# EAGLE design dc10 (EAGLE 5.06)
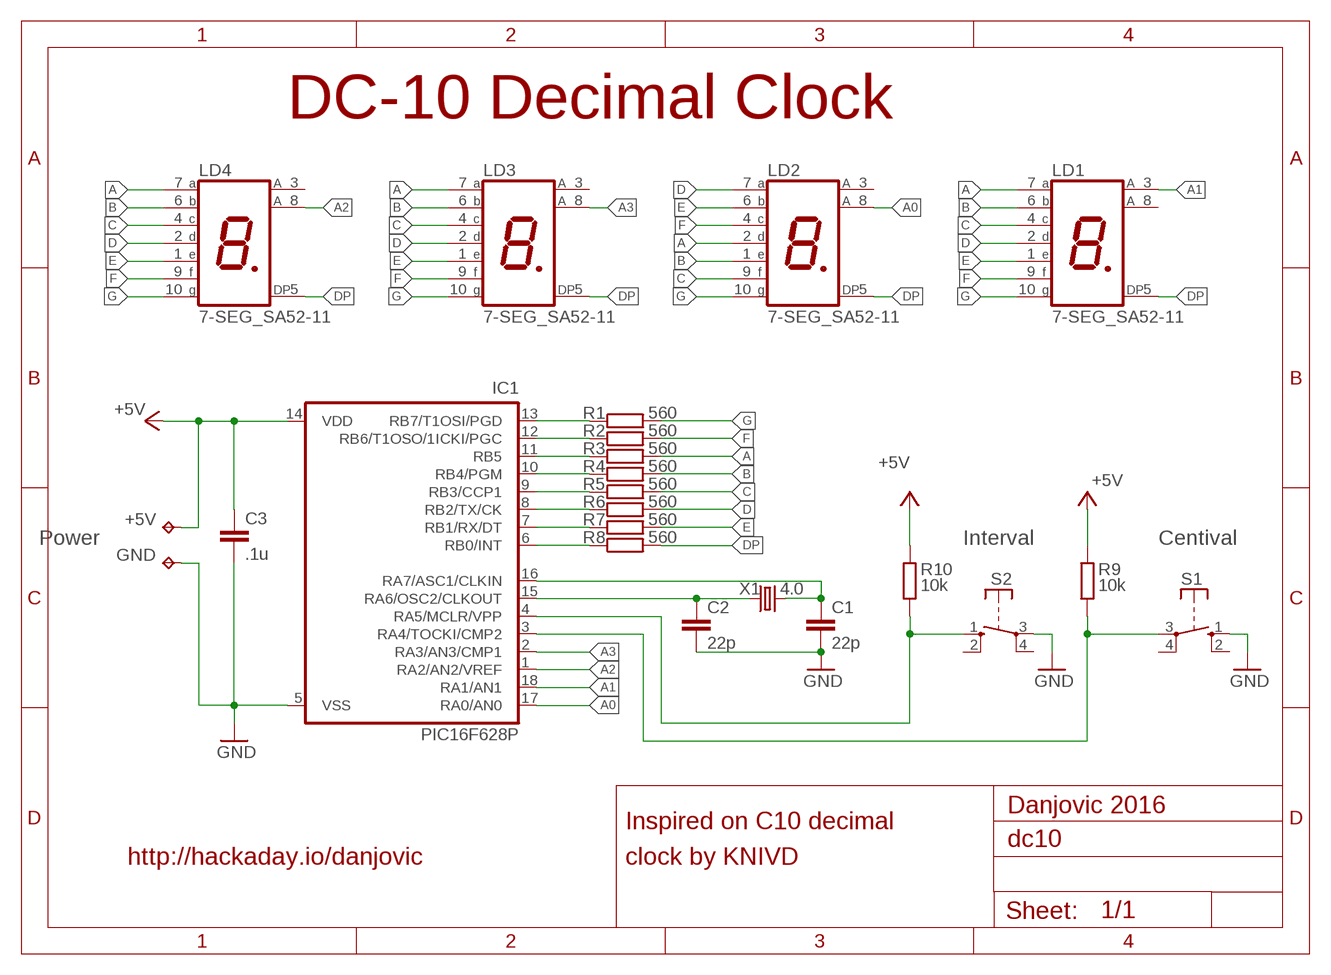
[diagram p0: schematic, sheet 1]

## Parts
+5V  TPPAD1-13  [P1-13]
C1  22p  C-EU050-024X044  [C050-024X044]
C2  22p  C-EU050-024X044  [C050-024X044]
C3  .1u  C-EU050-024X044  [C050-024X044]
GND  TPPAD1-13  [P1-13]
IC1  PIC16F628P  [DIL18]
LD1  7-SEG_SA52-11  [SA52-11]
LD2  7-SEG_SA52-11  [SA52-11]
LD3  7-SEG_SA52-11  [SA52-11]
LD4  7-SEG_SA52-11  [SA52-11]
R1  560  R-EU_0204/7  [0204/7]
R2  560  R-EU_0204/7  [0204/7]
R3  560  R-EU_0204/7  [0204/7]
R4  560  R-EU_0204/7  [0204/7]
R5  560  R-EU_0204/7  [0204/7]
R6  560  R-EU_0204/7  [0204/7]
R7  560  R-EU_0204/7  [0204/7]
R8  560  R-EU_0204/7  [0204/7]
R9  10k  R-EU_0204/7  [0204/7]
R10  10k  R-EU_0204/7  [0204/7]
S1  RACON12  [RACON12]
S2  RACON12  [RACON12]
X1  4.0  CRYSTALHC49U-V  [HC49U-V]

## Nets
+5V: +5V.1(TP) C3.1 IC1.14(VDD) R9.1 R10.1
A: LD1.7(A) LD2.2(D) LD3.7(A) LD4.7(A) R3.2
A0: IC1.17(RA0/AN0) LD2.8(A)
A1: IC1.18(RA1/AN1) LD1.3(A)
A2: IC1.1(RA2/AN2/VREF) LD4.8(A)
A3: IC1.2(RA3/AN3/CMP1) LD3.8(A)
A4: IC1.3(RA4/TOCKI/CMP2) R9.2 S1.3(P)
A5: IC1.4(RA5/MCLR/VPP) R10.2 S2.1(S)
B: LD1.6(B) LD2.1(E) LD3.6(B) LD4.6(B) R4.2
B0: IC1.6(RB0/INT) R8.1
B1: IC1.7(RB1/RX/DT) R7.1
B2: IC1.8(RB2/TX/CK) R6.1
B3: IC1.9(RB3/CCP1) R5.1
B4: IC1.10(RB4/PGM) R4.1
B5: IC1.11(RB5) R3.1
B6: IC1.12(RB6/T1OSO/1ICKI/PGC) R2.1
B7: IC1.13(RB7/T1OSI/PGD) R1.1
C: LD1.4(C) LD2.9(F) LD3.4(C) LD4.4(C) R5.2
D: LD1.2(D) LD2.7(A) LD3.2(D) LD4.2(D) R6.2
DP: LD1.5(DP) LD2.5(DP) LD3.5(DP) LD4.5(DP) R8.2
E: LD1.1(E) LD2.6(B) LD3.1(E) LD4.1(E) R7.2
F: LD1.9(F) LD2.4(C) LD3.9(F) LD4.9(F) R2.2
G: LD1.10(G) LD2.10(G) LD3.10(G) LD4.10(G) R1.2
GND: C1.2 C2.2 C3.2 GND.1(TP) IC1.5(VSS) S1.1(S) S2.3(P)
OSC1: C1.1 IC1.16(RA7/ASC1/CLKIN) X1.2
OSC2: C2.1 IC1.15(RA6/OSC2/CLKOUT) X1.1
Unconnected: LD1.8(A) LD2.3(A) LD3.3(A) LD4.3(A) S1.2(S) S1.4(P) S2.2(S) S2.4(P)

## Notes on the sheet
- DC-10 Decimal Clock
- Power | Interval | Centival
- Danjovic 2016
- Inspired on C10 decimal
- http://hackaday.io/danjovic | clock by KNIVD

## Library data of the parts
+5V GND = testpad:TP: Test pad
C1-C3 = rcl:C-EU: CAPACITOR, European symbol
IC1 = microchip:PIC16*F62: FLASH-Based 8-Bit CMOS Microcontroller Source: http://ww1.microchip.com/downloads/en/DeviceDoc/40300C.pdf
LD1-LD4 = display-kingbright:7-SEG_: Kingbright 14.2mm (0.56 INCH) SINGLE DIGIT NUMERIC DUISPLAY Source: SA56-11EWA(Ver1189471036.pdf
R1-R10 = rcl:R-EU_: RESISTOR, European symbol
S1 S2 = switch-misc:RACON12: ITT SWITCH
X1 = crystal:CRYSTAL: CRYSTAL

## Board
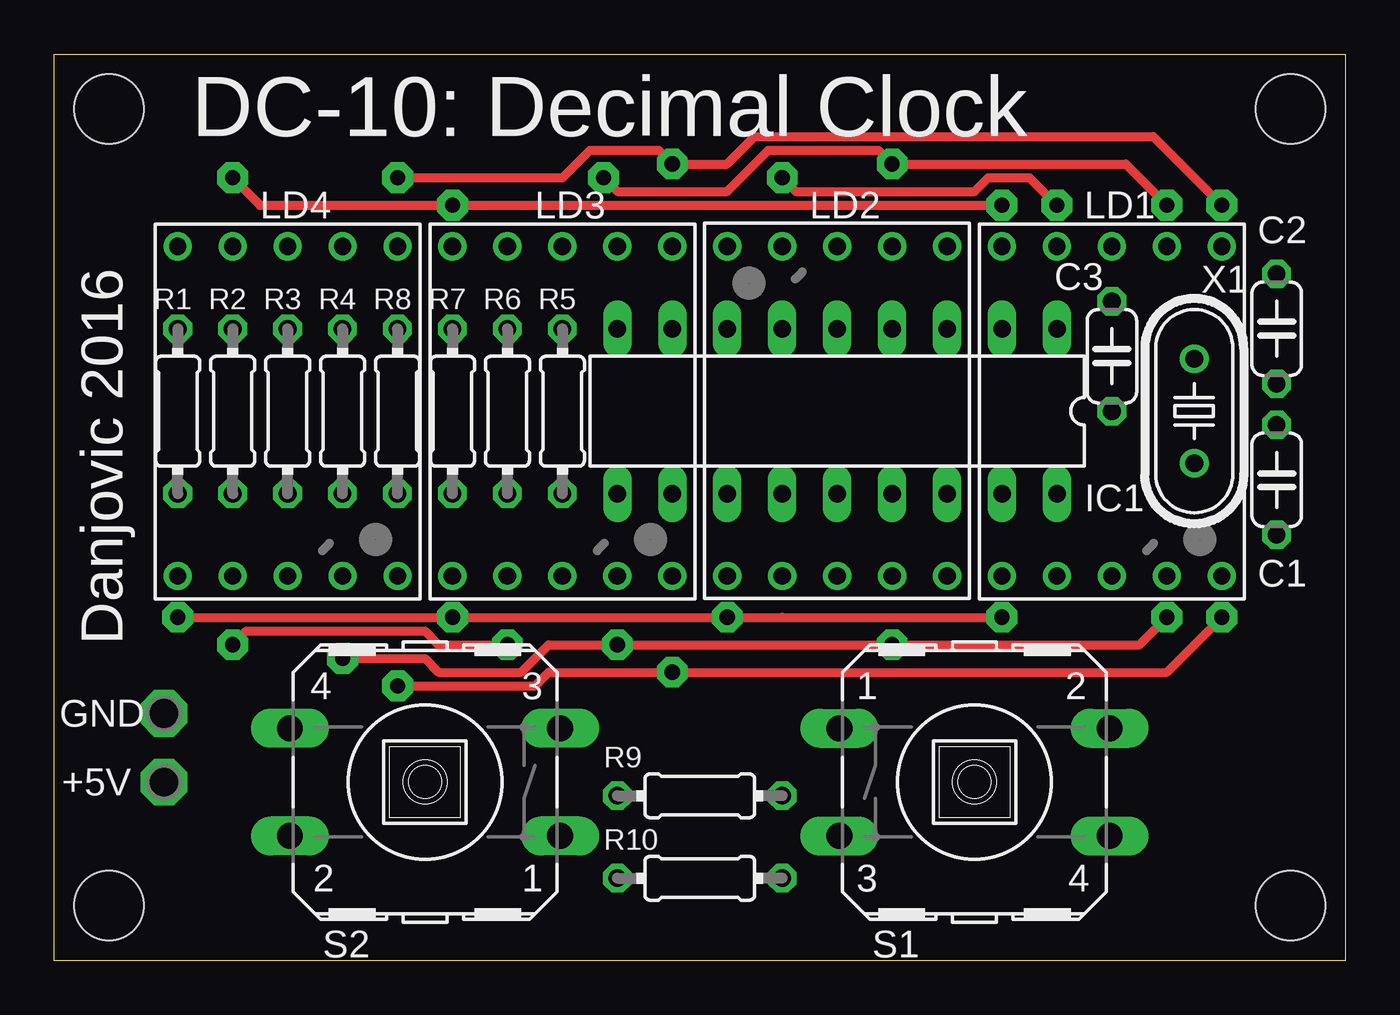
[diagram p1: board, top side]
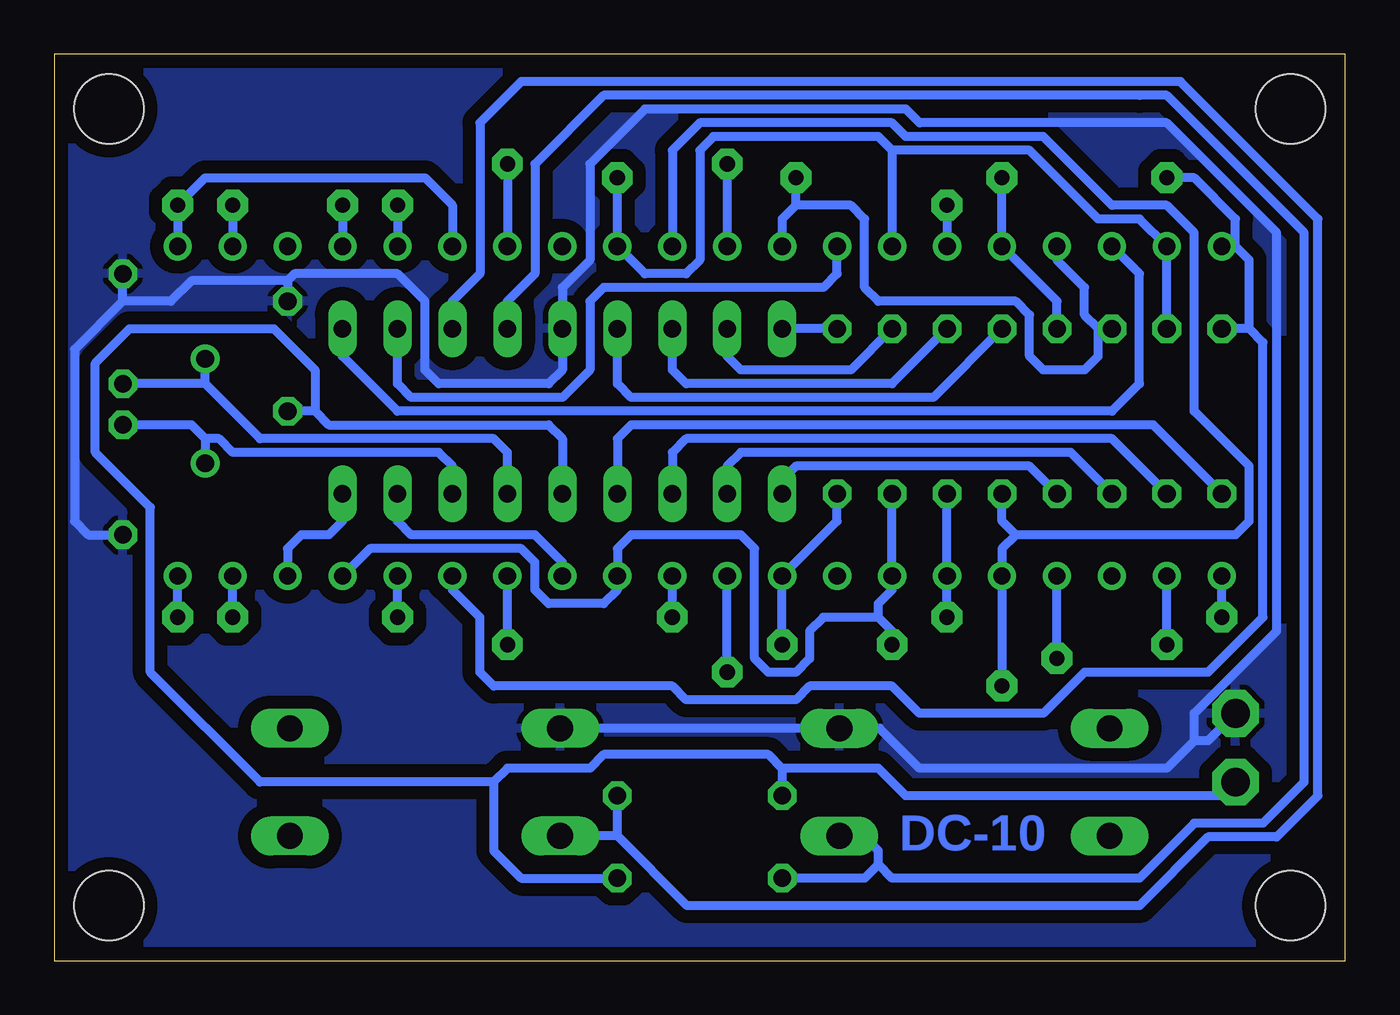
[diagram p2: board, bottom side, seen from below]

Size 59.69 x 41.91 mm. Coordinates in mm from the lower left corner, seen from the top.
Outline: 0,0 0,41.91 59.69,41.91 59.69,0 0,0
Copper layers (1*16): Top 0.035mm / dielectric 1.5mm / Bottom 0.035mm
Design rules "default *": minimum track width 10mil, minimum drill 24mil, track to track 8mil, track to pad 8mil, pad to pad 8mil, via to via 8mil, smd to smd 8mil, copper to edge 25mil, drill to drill 8mil, minimum pad ring 10mil, minimum via ring 8mil, stop-mask expansion 4mil, vias tented up to drill 0mil, thermal gap 10mil
Holes 3.2 mm at 2.54,39.37 57.15,39.37 57.15,2.54 2.54,2.54

### Footprints (pad centres in the part's own frame; a part is rotated, then mirrored left to right if it is on the bottom)
P1-13 = drill 1.321 pad 2.159 octagon: 1 0,0
C050-024X044 = drill 0.813 octagon: 1 -2.54,0; 2 2.54,0
DIL18 = drill 0.813 long: 1 -10.16,-3.81; 2 -7.62,-3.81; 3 -5.08,-3.81; 4 -2.54,-3.81; 5 0,-3.81; 6 2.54,-3.81; 7 5.08,-3.81; 8 7.62,-3.81; 9 10.16,-3.81; 10 10.16,3.81; 11 7.62,3.81; 12 5.08,3.81; 13 2.54,3.81; 14 0,3.81; 15 -2.54,3.81; 16 -5.08,3.81; 17 -7.62,3.81; 18 -10.16,3.81
SA52-11 = drill 0.8 round: 1 -5.08,-7.62; 2 -2.54,-7.62; 3 0,-7.62; 4 2.54,-7.62; 5 5.08,-7.62; 6 5.08,7.62; 7 2.54,7.62; 8 0,7.62; 9 -2.54,7.62; 10 -5.08,7.62
0204/7 = drill 0.813 octagon: 1 -3.81,0; 2 3.81,0
RACON12 = drill 1.194 long: 1 -6.248,2.489; 2 6.248,2.489; 3 -6.248,-2.489; 4 6.248,-2.489
HC49U-V = drill 0.813 round: 1 -2.413,0; 2 2.413,0

### Placement (x,y rotation side)
+5V  5.08,8.26 0 top
C1  56.52,22.23 270 top
C2  56.52,29.21 90 top
C3  48.89,27.94 90 top
GND  5.08,11.43 0 top
IC1  36.19,25.4 180 top
LD1  48.89,25.4 0 top
LD2  36.19,25.4 180 top
LD3  23.5,25.4 0 top
LD4  10.79,25.4 0 top
R1  5.71,25.4 90 top
R2  8.25,25.4 90 top
R3  10.79,25.4 90 top
R4  13.34,25.4 90 top
R5  23.5,25.4 270 top
R6  20.96,25.4 270 top
R7  18.42,25.4 270 top
R8  15.88,25.4 270 top
R9  29.85,7.62 0 top
R10  29.85,3.81 180 top
S1  42.55,8.26 0 top
S2  17.14,8.26 180 top
X1  52.7,25.4 270 top

### Tracks (layer width: path | path; a pad name or v marks a point on that pad's centre or on a via)
+5V
  Bottom 0.406: IC1.14 36.19,24.13 36.83,24.77 46.99,24.77 47.62,25.4 | 47.62,25.4 C3.1 | 47.62,25.4 47.62,27.3 49.53,29.21 56.2,29.21 57.78,27.62 57.78,23.49 55.24,20.95 55.24,13.33 50.16,8.26 39.37,8.26 | 26.04,8.89 21.59,8.89 20.32,7.62 5.71,7.62 +5V.1 | 26.04,8.89 26.67,9.53 34.29,9.53 34.92,8.89 38.73,8.89 39.37,8.26 | 26.04,8.89 R9.1 | R10.1 38.1,3.81 39.37,5.08 39.37,8.26
A  (via drill 0.7 pad 1.42)
  Top 0.406: v51.44,34.92 49.53,36.83 v38.73,36.83 38.1,37.46 33.02,37.46 31.11,35.56 26.04,35.56 v25.4,36.2
  Bottom 0.406: v51.44,34.92 LD1.7 | v38.73,36.83 LD2.2 | LD3.7 26.04,34.29 25.4,34.92 | 25.4,34.92 22.86,34.92 22.22,34.29 22.22,31.11 21.59,30.48 15.24,30.48 14.61,29.84 14.61,27.94 13.97,27.3 12.07,27.3 11.43,27.94 11.43,29.21 | 11.43,29.21 R3.2 | LD4.7 13.34,32.38 12.07,31.11 12.07,29.84 11.43,29.21 | 25.4,34.92 v25.4,36.2
A0
  Bottom 0.406: IC1.17 43.81,20.32 43.18,19.68 38.1,19.68 37.47,19.68 36.19,18.41 LD2.8
A1
  Bottom 0.406: IC1.18 46.36,20.32 46.99,19.68 48.26,19.68 48.89,19.05 LD1.3
A2
  Bottom 0.406: IC1.1 46.36,27.94 43.81,25.4 10.79,25.4 9.52,26.67 9.52,31.75 LD4.8
A3
  Bottom 0.406: LD3.8 23.5,31.75 24.13,31.11 25.4,31.11 34.29,31.11 34.92,30.48 34.92,27.3 36.19,26.03 43.18,26.03 43.81,26.67 IC1.2
A4
  Bottom 0.406: IC1.3 41.28,30.48 40,31.75 40,38.73 38.1,40.64 8.89,40.64 7.62,40.64 1.27,34.29 1.27,7.62 3.18,5.71 6.35,5.71 9.52,2.54 30.43,2.54 33.66,5.77 | 33.66,5.77 R9.2 | 33.66,5.77 S1.3
A5
  Bottom 0.406: IC1.4 38.73,30.48 37.47,31.75 37.47,36.83 34.29,40 9.52,40 8.25,40 1.91,33.66 1.91,8.26 3.81,6.35 6.98,6.35 9.52,3.81 20.96,3.81 21.59,4.44 | 21.59,4.44 22.22,3.81 R10.2 | S2.1 22.28,5.77 21.59,5.08 21.59,4.44
B  (via drill 0.7 pad 1.42)
  Top 0.406: v53.97,34.92 50.8,38.1 32.39,38.1 31.11,36.83 v28.57,36.83 27.94,37.46 24.76,37.46 23.5,36.2 v15.88,36.2
  Bottom 0.406: R4.2 13.34,30.48 LD4.6 v15.88,36.2 | v28.57,36.83 LD3.6 | LD1.6 v53.97,34.92 52.7,36.2 42.55,36.2 41.28,34.92 LD2.1
B0
  Bottom 0.406: IC1.6 33.66,26.67 33.02,26.03 19.05,26.03 R8.1
B1
  Bottom 0.406: IC1.7 31.11,27.3 30.48,26.67 20.96,26.67 R7.1
B2
  Bottom 0.406: IC1.8 28.57,27.94 27.94,27.3 22.86,27.3 R6.1
B3
  Bottom 0.406: R5.1 IC1.9
B4
  Bottom 0.406: IC1.10 26.04,22.23 25.4,22.86 14.61,22.86 R4.1
B5
  Bottom 0.406: IC1.11 28.57,22.86 27.94,23.49 12.7,23.49 R3.1
B6
  Bottom 0.406: IC1.12 31.11,23.49 30.48,24.13 10.79,24.13 R2.1
B7
  Bottom 0.406: IC1.13 33.66,24.13 33.02,24.77 8.89,24.77 R1.1
C  (via drill 0.7 pad 1.42)
  Top 0.406: v13.34,13.97 17.14,13.97 17.78,13.33 21.59,13.33 22.86,14.6 v26.04,14.6 v38.73,14.6 50.16,14.6 v51.44,15.87
  Bottom 0.406: R5.2 23.5,20.32 LD3.4 v26.04,14.6 | v13.34,13.97 LD4.4 | v38.73,14.6 LD2.9 | v51.44,15.87 LD1.4
D  (via drill 0.7 pad 1.42)
  Top 0.406: v8.25,14.6 8.89,15.24 17.14,15.24 17.78,14.6 v20.96,14.6
  Bottom 0.406: R6.2 LD3.2 20.96,17.14 21.59,16.51 21.59,15.87 | v8.25,14.6 LD4.2 | v20.96,14.6 20.96,15.24 21.59,15.87 | LD1.2 45.08,19.05 38.1,19.05 37.47,18.41 37.47,17.14 36.83,16.51 34.29,16.51 33.66,17.14 LD2.7 33.66,19.05 33.02,19.68 27.94,19.68 27.3,19.05 27.3,13.97 26.67,13.33 25.4,13.33 24.76,13.97 24.76,15.24 24.13,15.87 21.59,15.87
DP  (via drill 0.7 pad 1.42)
  Top 0.406: v15.88,12.7 22.22,12.7 22.86,13.33 v28.57,13.33 51.44,13.33 v53.97,15.87
  Bottom 0.406: v15.88,12.7 LD4.5 15.88,19.05 15.24,19.68 | v28.57,13.33 LD3.5 | v53.97,15.87 LD1.5 | LD2.5 31.11,37.46 29.85,38.73 20.96,38.73 20.32,38.1 13.97,38.1 10.79,34.92 8.25,34.92 6.98,33.66 6.98,25.4 4.45,22.86 4.45,20.32 5.08,19.68 15.24,19.68 | R8.2 15.88,20.32 15.24,19.68
E  (via drill 0.7 pad 1.42)
  Top 0.406: v5.71,15.87 v18.42,15.87 v31.11,15.87 33.66,15.87 v43.81,15.87
  Bottom 0.406: R7.2 LD3.1 v18.42,15.87 | v5.71,15.87 LD4.1 | v31.11,15.87 LD2.6 | v43.81,15.87 LD1.1
F  (via drill 0.7 pad 1.42)
  Top 0.406: v33.66,36.2 34.29,35.56 42.55,35.56 43.18,36.2 45.08,36.2 v46.36,34.92
  Bottom 0.406: R2.2 LD4.9 9.52,34.29 11.43,34.29 14.61,37.46 20.96,37.46 | v33.66,36.2 LD2.4 32.39,31.75 30.48,31.75 29.85,32.38 29.85,37.46 29.21,38.1 21.59,38.1 20.96,37.46 | v46.36,34.92 LD1.9 | 20.96,37.46 LD3.9
G  (via drill 0.7 pad 1.42)
  Top 0.406: v43.81,34.92 v18.42,34.92 9.52,34.92 v8.25,36.2
  Bottom 0.406: 4.45,29.21 4.45,32.38 5.08,33.02 | v43.81,34.92 LD1.10 | v18.42,34.92 LD3.10 | LD4.10 5.08,33.02 | 5.08,33.02 5.08,34.29 6.98,36.2 v8.25,36.2 | LD2.10 41.28,17.14 40,15.87 40,13.33 39.37,12.7 31.11,12.7 30.48,12.06 25.4,12.06 24.76,12.7 20.96,12.7 19.68,11.43 13.97,11.43 12.07,13.33 6.35,13.33 3.81,15.87 3.81,28.57 4.45,29.21 | 4.45,29.21 R1.2
GND
  Bottom 0.406: 48.89,31.43 48.58,31.75 43.81,31.75 42.55,30.48 42.55,27.3 41.91,26.67 36.83,26.67 36.19,27.3 IC1.5 36.19,31.11 34.92,32.38 34.92,36.83 32.39,39.37 20.32,39.37 19.68,38.73 8.25,38.73 3.18,33.66 3.18,15.24 6.98,11.43 6.98,10.16 | 48.89,31.43 C3.2 | 48.89,31.43 53.34,31.43 54.29,30.48 56.52,30.48 | 56.52,30.48 58.74,28.26 58.74,20.32 58.1,19.68 C1.2 | 56.52,30.48 C2.2 | 6.98,10.16 8.25,8.89 19.68,8.89 21.54,10.74 S2.3 S1.1 | GND.1 6.35,10.16 6.98,10.16
  pour Bottom (isolate 0.61): 0,0 59.69,0 59.69,41.91 0,41.91
OSC1
  Bottom 0.406: IC1.16 41.28,22.86 41.91,23.49 51.44,23.49 52.07,24.13 52.7,24.13 | 52.7,24.13 53.34,24.77 C1.1 | 52.7,24.13 X1.2
OSC2
  Bottom 0.406: IC1.15 38.73,23.49 39.37,24.13 50.16,24.13 52.7,26.67 | 52.7,26.67 C2.1 | 52.7,26.67 X1.1

### Text on the board
Bottom: DC-10
tNames: DC-10: Decimal Clock | Danjovic 2016